# Altium schematic sheet rc.SchDoc
size A4
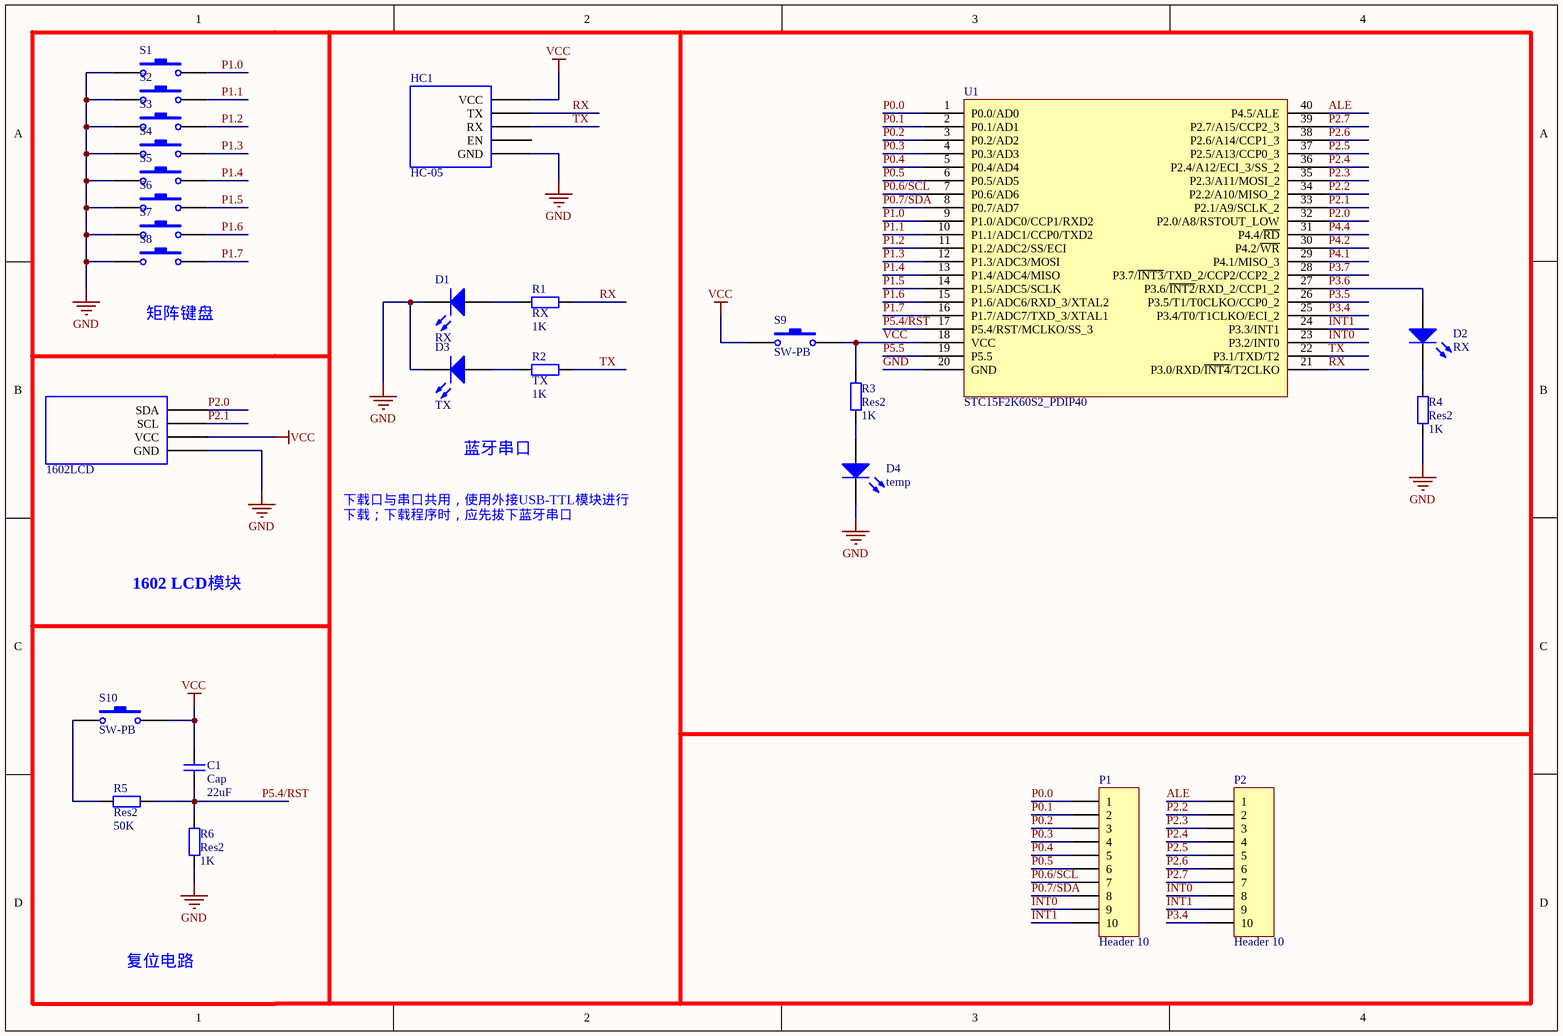
[diagram p0: rc.SchDoc]

## Parts
C1  Cap  value 22uF  [RAD-0.3]
D1  RX  [LED-0]
D2  RX  [LED-0]
D3  TX  [LED-0]
D4  temp  [LED-0]
HC1  HC-05
HC-1  1602LCD  (part C of 3)
P1  Header 10  [HDR1X10]
P2  Header 10  [HDR1X10]
R1  RX  value 1K  [AXIAL-0.4]
R2  TX  value 1K  [AXIAL-0.4]
R3  Res2  value 1K  [AXIAL-0.4]
R4  Res2  value 1K  [AXIAL-0.4]
R5  Res2  value 50K  [AXIAL-0.4]
R6  Res2  value 1K  [AXIAL-0.4]
S1  SW-PB  [SPST-2]  (value not drawn)
S2  SW-PB  [SPST-2]  (value not drawn)
S3  SW-PB  [SPST-2]  (value not drawn)
S4  SW-PB  [SPST-2]  (value not drawn)
S5  SW-PB  [SPST-2]  (value not drawn)
S6  SW-PB  [SPST-2]  (value not drawn)
S7  SW-PB  [SPST-2]  (value not drawn)
S8  SW-PB  [SPST-2]  (value not drawn)
S9  SW-PB  [SPST-2]
S10  SW-PB  [SPST-2]
U1  STC15F2K60S2_PDIP40  [DIP40]

## Nets
GND: D1.2(K) D3.2(K) D4.2(K) HC1.37(GND) HC-1.28(GND) R4.1 R6.1 S1.1 S2.1 S3.1 S4.1 S5.1 S6.1 S7.1 S8.1 U1.20(GND)
VCC: C1.2 HC1.33(VCC) HC-1.27(VCC) R3.2 S9.1 S9.2 S10.2 U1.18(VCC)
ALE: P2.1 U1.40(P4.5/ALE)
INT0: P1.9 P2.8 U1.23(P3.2/INT0)
INT1: P1.10 P2.9 U1.24(P3.3/INT1)
P0.0: P1.1 U1.1(P0.0/AD0)
P0.1: P1.2 U1.2(P0.1/AD1)
P0.2: P1.3 U1.3(P0.2/AD2)
P0.3: P1.4 U1.4(P0.3/AD3)
P0.4: P1.5 U1.5(P0.4/AD4)
P0.5: P1.6 U1.6(P0.5/AD5)
P0.6/SCL: P1.7 U1.7(P0.6/AD6)
P0.7/SDA: P1.8 U1.8(P0.7/AD7)
P1.0: S1.2 U1.9(P1.0/ADC0/CCP1/RXD2)
P1.1: S2.2 U1.10(P1.1/ADC1/CCP0/TXD2)
P1.2: S3.2 U1.11(P1.2/ADC2/SS/ECI)
P1.3: S4.2 U1.12(P1.3/ADC3/MOSI)
P1.4: S5.2 U1.13(P1.4/ADC4/MISO)
P1.5: S6.2 U1.14(P1.5/ADC5/SCLK)
P1.6: S7.2 U1.15(P1.6/ADC6/RXD_3/XTAL2)
P1.7: S8.2 U1.16(P1.7/ADC7/TXD_3/XTAL1)
P2.0: HC-1.25(SDA) U1.32(P2.0/A8/RSTOUT_LOW)
P2.1: HC-1.26(SCL) U1.33(P2.1/A9/SCLK_2)
P2.2: P2.2 U1.34(P2.2/A10/MISO_2)
P2.3: P2.3 U1.35(P2.3/A11/MOSI_2)
P2.4: P2.4 U1.36(P2.4/A12/ECI_3/SS_2)
P2.5: P2.5 U1.37(P2.5/A13/CCP0_3)
P2.6: P2.6 U1.38(P2.6/A14/CCP1_3)
P2.7: P2.7 U1.39(P2.7/A15/CCP2_3)
P3.4: P2.10 U1.25(P3.4/T0/T1CLKO/ECI_2)
P3.5: U1.26(P3.5/T1/T0CLKO/CCP0_2)
P3.6: D2.1(A) U1.27(P3.6/~{INT2}/RXD_2/CCP1_2)
P3.7: U1.28(P3.7/~{INT3}/TXD_2/CCP2/CCP2_2)
P4.1: U1.29(P4.1/MISO_3)
P4.2: U1.30(P4.2/~{WR})
P4.4: U1.31(P4.4/~{RD})
P5.4/RST: C1.1 R5.2 R6.2 U1.17(P5.4/RST/MCLKO/SS_3)
P5.5: U1.19(P5.5)
RX: HC1.34(TX) R1.2 U1.21(P3.0/RXD/~{INT4}/T2CLKO)
TX: HC1.35(RX) R2.2 U1.22(P3.1/TXD/T2)
NetD1_1: D1.1(A) R1.1
NetD2_2: D2.2(K) R4.2
NetD3_1: D3.1(A) R2.1
NetD4_1: D4.1(A) R3.1
NetR5_1: R5.1 S10.1

Not connected (* = marked no-connect by the designer): HC1 36(EN)

## Notes on the sheet
- (near S8) 矩阵键盘
- 蓝牙串口
- 下载口与串口共用，使用外接USB-TTL模块进行下载；下载程序时，应先拔下蓝牙串口
- 1602 LCD模块
- 复位电路

## Library data of the parts
C1 = Cap: Capacitor; Published: 8-Jun-2000; LatestRevisionDate: 17-Jul-2002; LatestRevisionNote: Re-released for DXP Platform.; PackageReference: RAD-0.3; Publisher: Altium Limited; PackageDescription: Radial Cap, Thru-Hole; 2 Leads; 0.3 in Pin Spacing
D1-D4 = LED0: Typical INFRARED GaAs LED; Published: 8-Jun-2000; LatestRevisionDate: 08-Jul-2005; LatestRevisionNote: Mech Layer 1 removed.; PackageReference: LED-0; Publisher: Altium Limited; PackageDescription: LED; 2 Leads
HC-1 = HC-05
P1 P2 = Header 10: Header, 10-Pin; LatestRevisionDate: 17-Jul-2002; LatestRevisionNote: Re-released for DXP Platform.; Publisher: Altium Limited
R1-R6 = Res2: Resistor; Published: 8-Jun-2000; LatestRevisionDate: 17-Jul-2002; LatestRevisionNote: Re-released for DXP Platform.; PackageReference: AXIAL-0.4; Publisher: Altium Limited; PackageDescription: Axial Device, Thru-Hole; 2 Leads; 0.4 in Pin Spacing
S1-S10 = SW-PB: Switch; Published: 24-Mar-1999; LatestRevisionDate: 17-Jul-2002; LatestRevisionNote: Re-released for DXP Platform.; PackageReference: SPST-2; Publisher: Altium Limited; PackageDescription: Switch; 2 Leads